# EAGLE design spino_board (EAGLE 6.5.0)
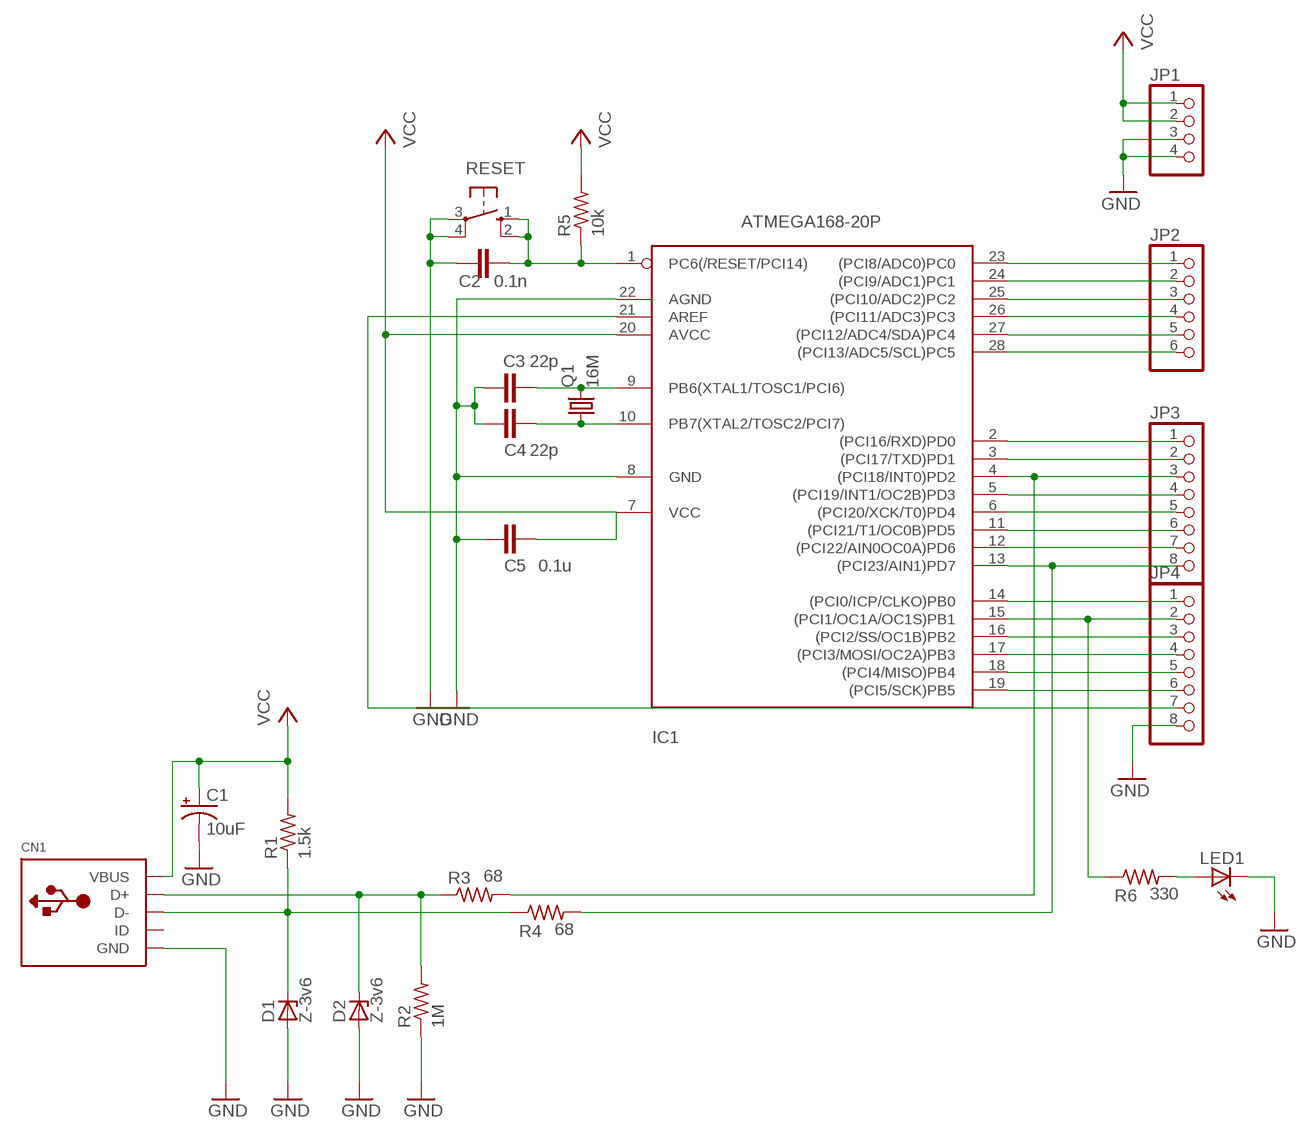
[diagram p0: schematic, sheet 1]

## Parts
C1  10uF  CPOL-USSANYO_D  [POL-CAP-COMMON]
C2  0.1n  C-EUCERAMIC-CAP-COMMON  [C025-060X050]
C3  22p  C-EUCERAMIC-CAP-COMMON  [C025-060X050]
C4  22p  C-EUCERAMIC-CAP-COMMON  [C025-060X050]
C5  0.1u  C-EUCERAMIC-CAP-COMMON  [C025-060X050]
CN1  USBMINIB  [USB-MINIB@1]
D1  Z-3v6  Z-5V1  [DO35Z7]
D2  Z-3v6  Z-5V1  [DO35Z7]
IC1  ATMEGA168-20P  [DIL28-3]
JP1  PINHD-1X4  [1X04]
JP2  PINHD-1X6  [1X06]
JP3  PINHD-1X8  [1X08]
JP4  PINHD-1X8  [1X08]
LED1  LED5MM  [LED5MM]
Q1  16M  CRYSTALHC49S  [HC49/S]
R1  1.5k  R-US_0207/10  [R-US-COMMON]
R2  1M  R-US_0207/10  [R-US-COMMON]
R3  68  R-US_0207/10  [R-US-COMMON]
R4  68  R-US_0207/10  [R-US-COMMON]
R5  10k  R-US_0207/10  [R-US-COMMON]
R6  330  R-US_0207/10  [R-US-COMMON]
RESET  10-XX  [B3F-10XX]

## Nets
GND: C1.- C2.2 C3.2 C4.2 C5.2 CN1.GND D1.A D2.A IC1.8(GND) IC1.22(AGND) JP1.3 JP1.4 JP4.8 LED1.K(C) R2.1 RESET.3(P) RESET.4(P1)
N$1: IC1.4((PCI18/INT0)PD2) JP3.3 R3.2
N$2: IC1.21(AREF) JP4.7
N$3: CN1.D- D1.C R1.1 R4.1
N$4: CN1.D+ D2.C R2.2 R3.1
N$5: IC1.13((PCI23/AIN1)PD7) JP3.8 R4.2
N$6: IC1.23((PCI8/ADC0)PC0) JP2.1
N$7: IC1.24((PCI9/ADC1)PC1) JP2.2
N$8: IC1.25((PCI10/ADC2)PC2) JP2.3
N$9: IC1.26((PCI11/ADC3)PC3) JP2.4
N$10: IC1.27((PCI12/ADC4/SDA)PC4) JP2.5
N$11: IC1.28((PCI13/ADC5/SCL)PC5) JP2.6
N$12: IC1.2((PCI16/RXD)PD0) JP3.1
N$13: IC1.3((PCI17/TXD)PD1) JP3.2
N$14: LED1.A R6.2
N$15: IC1.5((PCI19/INT1/OC2B)PD3) JP3.4
N$16: IC1.6((PCI20/XCK/T0)PD4) JP3.5
N$17: IC1.11((PCI21/T1/OC0B)PD5) JP3.6
N$18: IC1.12((PCI22/AIN0OC0A)PD6) JP3.7
N$20: IC1.14((PCI0/ICP/CLKO)PB0) JP4.1
N$21: IC1.15((PCI1/OC1A/OC1S)PB1) JP4.2 R6.1
N$22: IC1.16((PCI2/SS/OC1B)PB2) JP4.3
N$23: IC1.17((PCI3/MOSI/OC2A)PB3) JP4.4
N$24: IC1.18((PCI4/MISO)PB4) JP4.5
N$25: IC1.19((PCI5/SCK)PB5) JP4.6
N$26: C4.1 IC1.10(PB7(XTAL2/TOSC2/PCI7)) Q1.1
N$27: C3.1 IC1.9(PB6(XTAL1/TOSC1/PCI6)) Q1.2
N$28: C2.1 IC1.1(PC6(/RESET/PCI14)) R5.1 RESET.1(S) RESET.2(S1)
VCC: C1.+ C5.1 CN1.VBUS IC1.7(VCC) IC1.20(AVCC) JP1.1 JP1.2 R1.2 R5.2
Unconnected: CN1.ID

## Library data of the parts
C1 = datle-discrete:CPOL-US: POLARIZED CAPACITOR, American symbol
C2-C5 = datle-discrete:C-EU: CAPACITOR, European symbol
CN1 = datle-conn:USB: USB Connectors USBMINIB - Surface Mount Female Mini-B USB Connector 4UConnector: 06564 By microbuilder.eu Thru-hole RA Female Mini-B USB Connector 4UConnector: 18732 By ladyada.net
D1 D2 = datle-discrete:Z-5V1
IC1 = datle-mcu:ATMEGA168*P: MICROCONTROLLER 16 kBytes FLASH 1 kBytes SRAM 512 Bytes EEPROM USART 8-channel 10 bit ADC
JP1 = datle-conn:PINHD-1X4: PIN HEADER
JP2 = datle-conn:PINHD-1X6: PIN HEADER
JP3 JP4 = datle-conn:PINHD-1X8: PIN HEADER
LED1 = datle-discrete:LED: LEDs Standard schematic elements and footprints for 5mm, 3mm, 1206, and 0603 sized LEDs. 5mm - Spark Fun Electronics SKU : COM-00529 (and others)
Q1 = datle-discrete:CRYSTAL: CRYSTAL; OC_FARNELL: 1667008; OC_NEWARK: unknown
R1-R6 = datle-discrete:R-US_: RESISTOR, American symbol
RESET = datle-switch:10-XX: OMRON SWITCH; MPN: B3F-1000; OC_FARNELL: 176432; OC_NEWARK: 36M3542

## Board
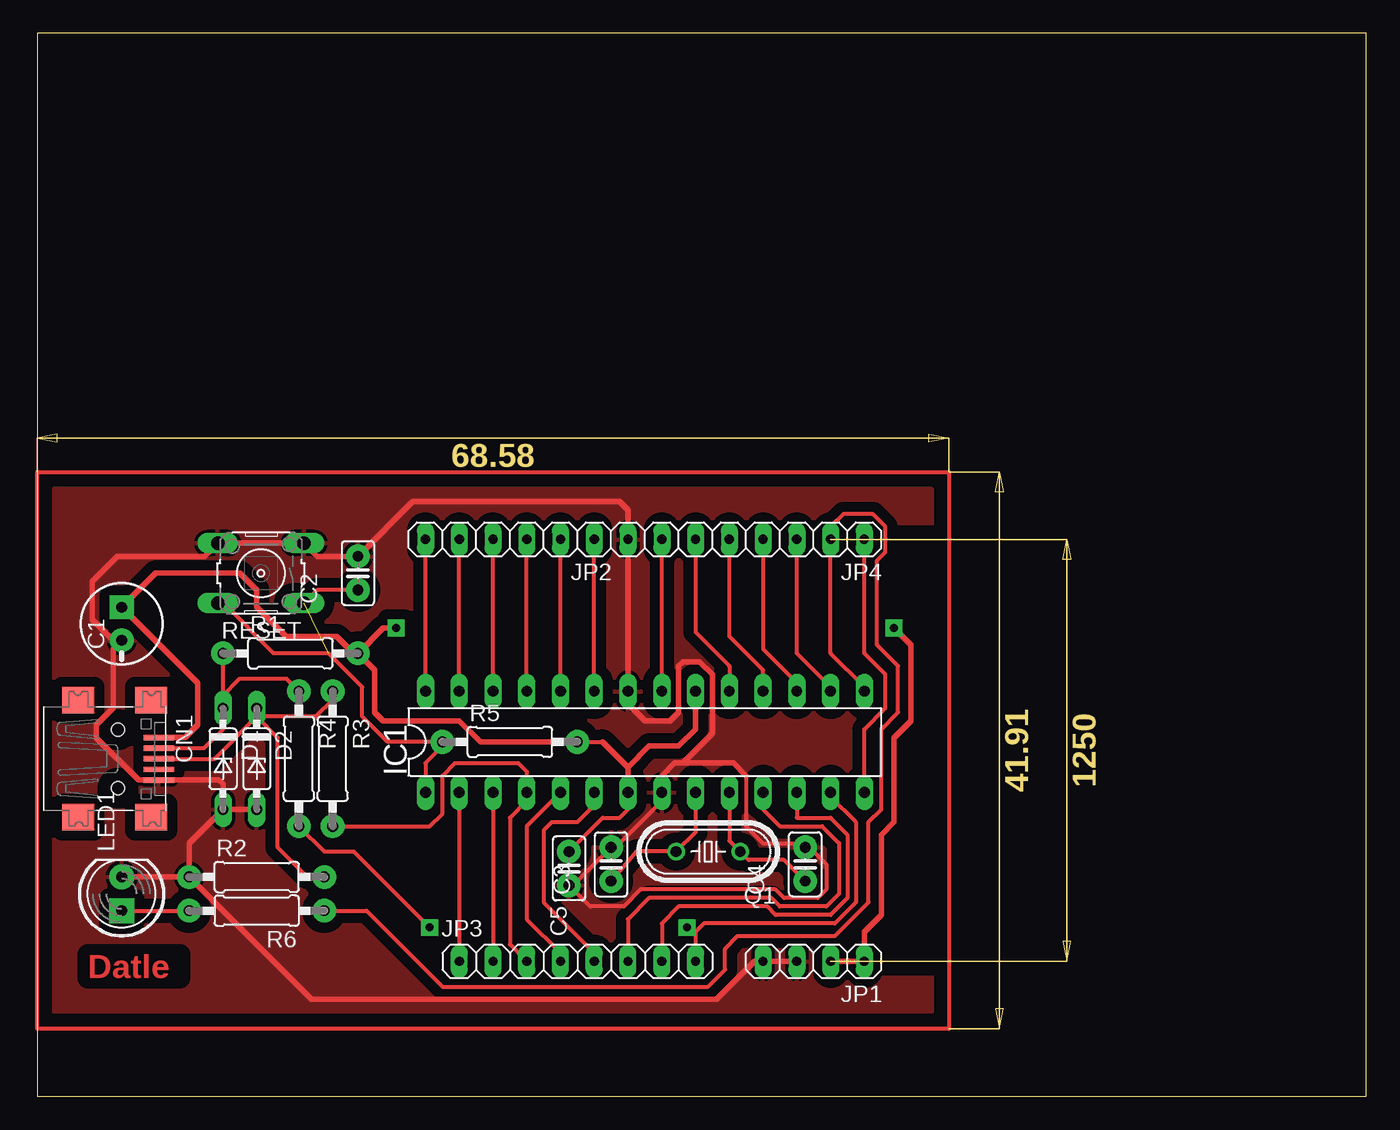
[diagram p1: board, top side]
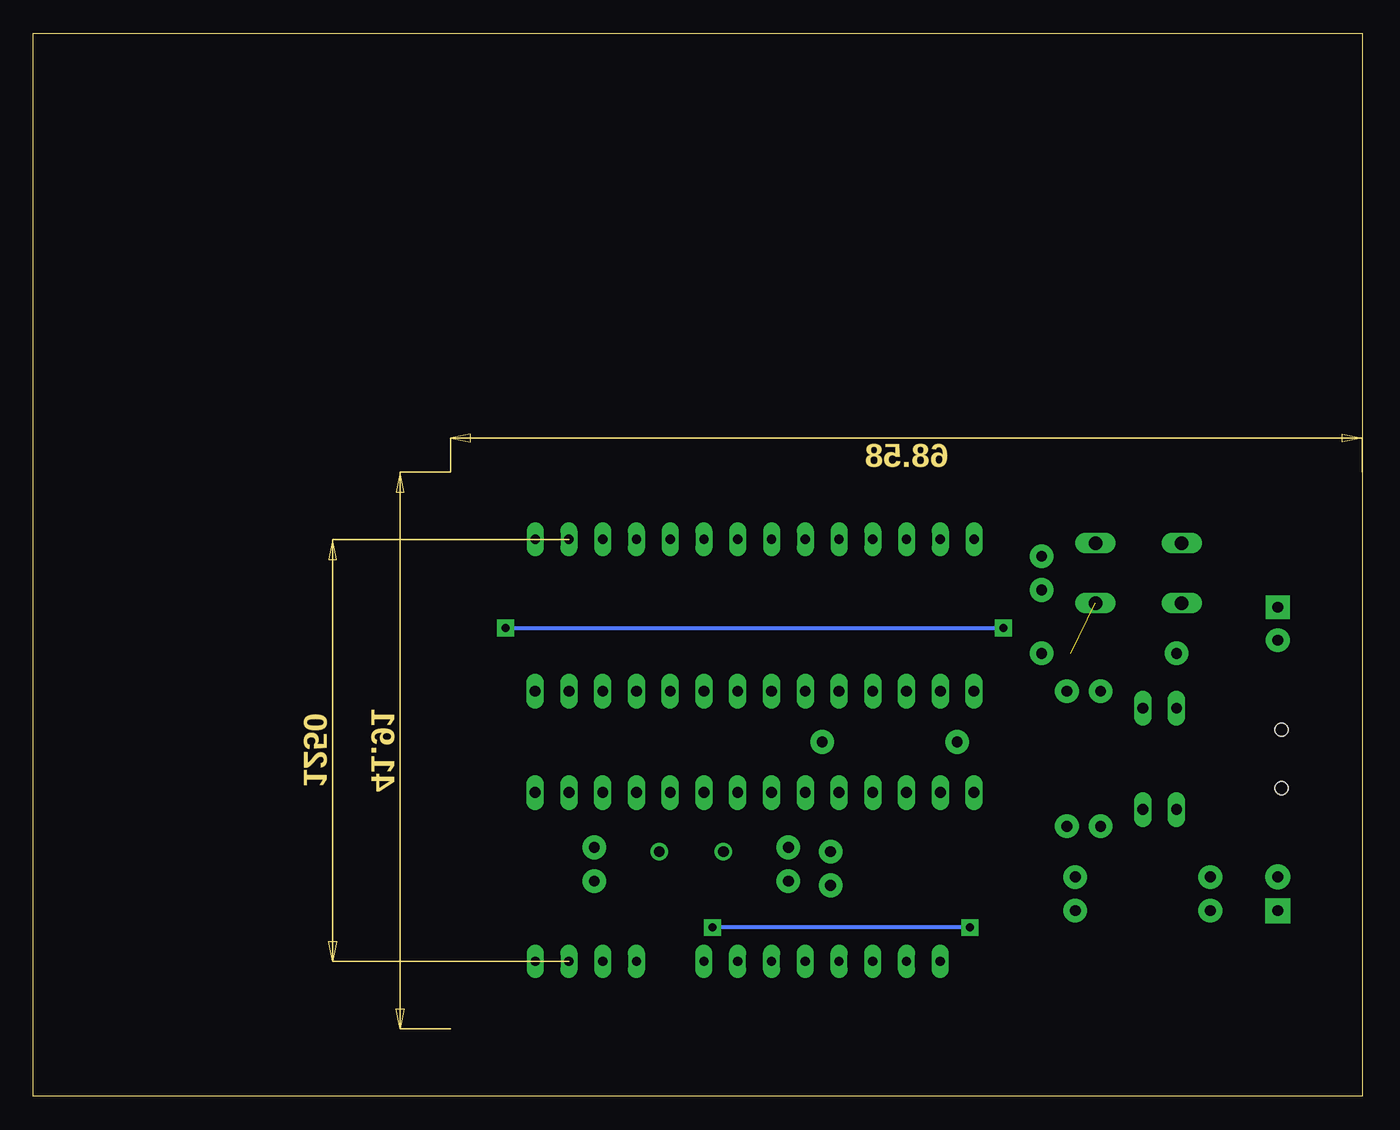
[diagram p2: board, bottom side, seen from below]

Size 100 x 80 mm. Coordinates in mm from the lower left corner, seen from the top.
Outline: 0,0 100,0 100,80 0,80 0,0
Copper layers (1*16): Top 0.035mm / dielectric 1.5mm / Bottom 0.035mm
Design rules "default": minimum track width 10mil, minimum drill 24mil, track to track 8mil, track to pad 8mil, pad to pad 8mil, via to via 8mil, smd to smd 8mil, copper to edge 40mil, drill to drill 8mil, minimum pad ring 10mil, minimum via ring 8mil, stop-mask expansion 4mil, vias tented up to drill 0mil, thermal gap 10mil

### Footprints (pad centres in the part's own frame; a part is rotated, then mirrored left to right if it is on the bottom)
POL-CAP-COMMON = drill 0.8 pad 1.778 square: + 1.25,0 | drill 0.8 pad 1.778: - -1.25,0
C025-060X050 = drill 0.813 pad 1.778: 1 -1.27,0; 2 1.27,0
USB-MINIB@1 = smd 0.4 x 2.308: D+ 0,4.064; D- -0.8,4.064; GND 1.6,4.064; ID 0.8,4.064; VBUS -1.6,4.064 | smd 2 x 2.4: GND1 -4.4,-2; GND2 -4.4,3.5; GND3 4.4,3.5; GND4 4.4,-2 | hole 1: -2.2,1; 2.2,1
DO35Z7 = drill 0.813 long: A 3.81,0; C -3.81,0
DIL28-3 = drill 0.813 long: 1 -16.51,-3.81; 2 -13.97,-3.81; 3 -11.43,-3.81; 4 -8.89,-3.81; 5 -6.35,-3.81; 6 -3.81,-3.81; 7 -1.27,-3.81; 8 1.27,-3.81; 9 3.81,-3.81; 10 6.35,-3.81; 11 8.89,-3.81; 12 11.43,-3.81; 13 13.97,-3.81; 14 16.51,-3.81; 15 16.51,3.81; 16 13.97,3.81; 17 11.43,3.81; 18 8.89,3.81; 19 6.35,3.81; 20 3.81,3.81; 21 1.27,3.81; 22 -1.27,3.81; 23 -3.81,3.81; 24 -6.35,3.81; 25 -8.89,3.81; 26 -11.43,3.81; 27 -13.97,3.81; 28 -16.51,3.81
1X04 = drill 0.7 pad 1.27 long: 1 -3.81,0; 2 -1.27,0; 3 1.27,0; 4 3.81,0
1X06 = drill 0.7 pad 1.27 long: 1 -6.35,0; 2 -3.81,0; 3 -1.27,0; 4 1.27,0; 5 3.81,0; 6 6.35,0
1X08 = drill 0.7 pad 1.27 long: 1 -8.89,0; 2 -6.35,0; 3 -3.81,0; 4 -1.27,0; 5 1.27,0; 6 3.81,0; 7 6.35,0; 8 8.89,0
LED5MM = drill 0.813 pad 1.88 square: A -1.27,0 | drill 0.813 pad 1.88: K 1.27,0
HC49/S = drill 0.813: 1 -2.413,0; 2 2.413,0
R-US-COMMON = drill 0.813 pad 1.778: 1 -5.08,0; 2 5.08,0
B3F-10XX = drill 1.016 long: 1 -3.251,2.261; 2 3.251,2.261; 3 -3.251,-2.261; 4 3.251,-2.261

### Placement (x,y rotation side)
C1  6.35,35.56 90 top
C2  24.13,39.37 90 top
C3  43.18,17.46 90 top
C4  57.78,17.46 90 top
C5  40.01,17.14 270 top
CN1  5.08,25.4 270 top
D1  13.97,25.4 270 top
D2  16.51,25.4 270 top
IC1  45.72,26.67 0 top
JP1  58.42,10.16 180 top
JP2  35.56,41.91 180 top
JP3  40.64,10.16 0 top
JP4  53.34,41.91 180 top
LED1  6.35,15.24 90 top
Q1  50.48,18.41 180 top
R1  19.05,33.34 0 top
R2  16.51,16.51 0 top
R3  22.23,25.4 270 top
R4  19.68,25.4 270 top
R5  35.56,26.67 0 top
R6  16.51,13.97 180 top
RESET  16.83,39.37 180 top

### Tracks (layer width: path | path; a pad name or v marks a point on that pad's centre or on a via)
GND
  Top 0.305: C1.- 5.7,34.31 | IC1.22 44.45,29.53 | IC1.8 46.67,22.54 46.67,21.91 43.81,19.05 C3.2 40.32,15.88 C5.2 41.59,14.29 44.13,14.29 45.4,15.56 55.56,15.56 56.2,14.92 58.74,14.92 59.37,15.56 59.37,17.46 58.1,18.73 C4.2 57.47,19.05 54.61,19.05 53.34,20.32 53.34,24.13 | JP1.4 JP1.3
  Top 0.406: D1.A 13.97,23.5 13.66,23.8 CN1.GND 7.63,23.8 4.45,26.99 4.45,27.94 5.71,29.21 5.71,33.67 C1.- | R2.1 11.43,19.05 D1.A | LED1.K R2.1 | D1.A D2.A | 53.34,24.13 52.39,25.08 48.58,25.08 | 48.58,25.08 47.94,25.08 46.99,24.13 | 5.7,34.31 4.13,35.88 4.13,38.73 6.03,40.64 12.59,40.64 RESET.4 RESET.3 21.07,40.64 C2.2 28.26,44.77 43.81,44.77 44.45,44.13 JP4.8 IC1.22 | 44.45,29.53 45.72,28.26 47.62,28.26 48.26,28.89 48.26,32.38 48.58,32.7 49.85,32.7 50.8,31.75 50.8,27.3 48.58,25.08 | JP1.3 53.98,10.16 51.12,7.3 20.64,7.3 R2.1
  pour Top (isolate 0.762): 2.54,45.72 67.31,45.72 67.31,6.35 1.27,6.35 1.27,45.72
N$1
  Top 0.305: JP3.3 35.56,11.43 35.56,20.95 36.83,22.23 IC1.4 36.83,24.45 36.2,25.08 31.43,25.08 30.48,24.13 30.48,21.27 29.53,20.32 R3.2
N$2
  Top 0.305: IC1.21 JP4.7
N$3
  Top 0.305: CN1.D- 12.55,26.2 13.97,27.62 D1.C | D1.C R1.1 | D1.C 13.97,30.16 15.24,31.43 18.73,31.43 R4.1
N$4
  Top 0.305: CN1.D+ 13.34,25.4 16.51,28.57 | 16.51,28.57 D2.C 17.14,28.57 20.95,28.57 22.23,29.84 R3.1 | R2.2 20.32,16.51 18.1,18.73 18.1,26.99 16.51,28.57
N$5  (via drill 0.6 pad 1.27)
  Top 0.305: 49.53,12.38 50.16,13.02 60.01,13.02 61.59,14.61 61.59,20.64 59.69,22.54 IC1.13 | 49.53,12.38 JP3.8 | R4.2 21.59,18.41 23.81,18.41 v29.53,12.7 | v48.9,12.7 49.21,12.7 49.53,12.38
  Bottom 0.305: v29.53,12.7 v48.9,12.7
N$6
  Top 0.305: IC1.23 JP2.1
N$7
  Top 0.305: IC1.24 JP2.2
N$8
  Top 0.305: IC1.25 JP2.3
N$9
  Top 0.305: IC1.26 JP2.4
N$10
  Top 0.305: IC1.27 JP2.5
N$11
  Top 0.305: IC1.28 JP2.6
N$12
  Top 0.305: IC1.2 JP3.1
N$13
  Top 0.305: IC1.3 JP3.2
N$14
  Top 0.305: LED1.A R6.2
N$15
  Top 0.305: IC1.5 36.83,20.32 36.83,13.34 39.37,10.79 JP3.4
N$16
  Top 0.305: JP3.5 41.91,10.79 38.1,14.61 38.1,20 38.73,20.64 40.64,20.64 41.91,21.91 IC1.6
N$17
  Top 0.305: JP3.6 44.45,13.34 46.04,14.92 55.24,14.92 55.88,14.29 59.37,14.29 60.33,15.24 60.33,19.05 59.05,20.32 55.88,20.32 54.61,21.59 IC1.11
N$18
  Top 0.305: IC1.12 57.15,20.95 59.69,20.95 60.96,19.68 60.96,14.92 59.69,13.65 55.56,13.65 54.93,14.29 48.26,14.29 46.99,13.02 JP3.7
N$19
  Top 0.305: 0,46.99 68.58,46.99 68.58,5.08 0,5.08 0,46.99
N$20
  Top 0.305: IC1.14 62.23,27.62 63.82,29.21 63.82,31.75 62.23,33.34 JP4.1
N$21
  Top 0.305: IC1.15 62.23,30.8 59.69,33.34 JP4.2 59.69,42.86 60.64,43.81 62.87,43.81 63.82,42.86 63.82,40.96 63.18,40.32 63.18,33.97 64.77,32.38 64.77,28.89 63.5,27.62 63.5,21.59 62.55,20.64 62.55,14.61 60.01,12.06 52.7,12.06 51.75,11.11 51.75,9.53 50.48,8.26 30.48,8.26 24.77,13.97 R6.1
N$22
  Top 0.305: IC1.16 59.69,30.8 57.15,33.34 JP4.3
N$23
  Top 0.305: JP4.4 54.61,33.66 57.15,31.11 IC1.17
N$24
  Top 0.305: IC1.18 54.61,32.07 52.07,34.61 JP4.5
N$25
  Top 0.305: JP4.6 49.53,34.92 52.07,32.38 IC1.19
N$26
  Top 0.305: IC1.10 52.07,19.24 Q1.1 53.53,17.78 56.2,17.78 C4.1
N$27
  Top 0.305: C3.1 45.09,18.41 Q1.2 49.53,19.88 IC1.9
N$28  (1 unrouted)
  Top 0.305: IC1.1 29.21,25.08 30.48,26.35 R5.1 26.35,26.67 24.45,28.57 24.45,30.8 21.91,33.34 17.78,33.34 13.97,37.15 13.61,37.15 RESET.2 | C2.1 21.07,38.1 RESET.1
VCC  (via drill 0.6 pad 1.27)
  Top 0.305: R5.2 42.55,26.67 | R1.2 23.81,33.34 | C5.1 42.55,20.95 43.81,20.95 44.45,21.59 IC1.7
  Top 0.406: 42.55,26.67 44.45,24.77 | 44.45,24.77 IC1.7 | R5.2 33.34,26.67 31.75,28.26 26.04,28.26 25.4,28.89 25.4,32.07 R1.2 26.04,35.24 v26.99,35.24 | 23.81,33.34 22.54,34.61 18.73,34.61 16.51,36.83 16.51,38.1 15.24,39.37 8.91,39.37 C1.+ 12.06,31.09 12.06,27.94 11.12,27 CN1.VBUS | IC1.20 49.53,27.62 48.26,26.35 46.04,26.35 44.45,24.77 | JP1.2 JP1.1 62.23,12.38 63.5,13.65 63.5,19.68 64.45,20.64 64.45,26.99 65.72,28.26 65.72,33.97 v64.45,35.24
  Bottom 0.305: v64.45,35.24 v26.99,35.24

### Text on the board
Top: Datle